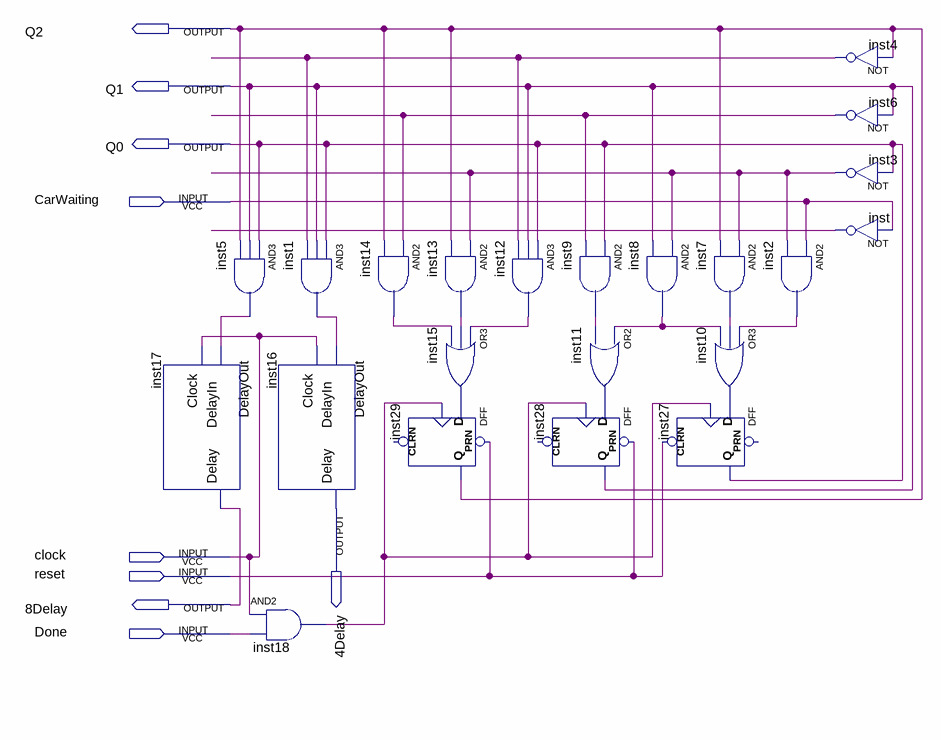
[diagram p0: schematic sheet]
// Quartus schematic TLC.bdf as structural Verilog: 22 symbols, 9 pins
module TLC (
  input  CarWaiting,
  input  clock,
  input  reset,
  input  Done,
  output Q2,
  output Q1,
  output Q0,
  output \4Delay ,
  output \8Delay 
);

  wire inst1_out, inst2_out, inst3_out, inst4_out, inst5_out, inst6_out, inst7_out, inst8_out, inst9_out,
       inst10_out, inst11_out, inst12_out, inst13_out, inst14_out, inst15_out, inst18_out, inst_out;

  DelayOut inst17 (.DelayIn(inst5_out), .Clock(clock), .Delay(\8Delay ));
  and inst5 (inst5_out, Q0, Q1, Q2);
  and inst18 (inst18_out, clock, Done);
  and inst1 (inst1_out, Q0, Q1, inst4_out);
  DelayOut inst16 (.DelayIn(inst1_out), .Clock(clock), .Delay(\4Delay ));
  and inst14 (inst14_out, inst6_out, Q2);
  DFF inst29 (.CLK(inst18_out), .D(inst15_out), .PRN(reset), .Q(Q2));  // open: CLRN
  and inst13 (inst13_out, inst3_out, Q2);
  or inst15 (inst15_out, inst12_out, inst13_out, inst14_out);
  and inst12 (inst12_out, Q0, Q1, inst4_out);
  DFF inst28 (.CLK(inst18_out), .D(inst11_out), .PRN(reset), .Q(Q1));  // open: CLRN
  and inst8 (inst8_out, inst3_out, Q1);
  and inst9 (inst9_out, Q0, inst6_out);
  or inst11 (inst11_out, inst8_out, inst9_out);
  and inst7 (inst7_out, inst3_out, Q2);
  or inst10 (inst10_out, inst2_out, inst7_out, inst8_out);
  DFF inst27 (.CLRN(reset), .CLK(inst18_out), .D(inst10_out), .Q(Q0));  // open: PRN
  and inst2 (inst2_out, CarWaiting, inst3_out);
  not inst4 (inst4_out, Q2);
  not inst6 (inst6_out, Q1);
  not inst3 (inst3_out, Q0);
  not inst (inst_out, CarWaiting);
endmodule
